# Altium schematic sheet CW342_Edge.SchDoc: <Enter Sheet Title>
size Letter; Organization: NewAE Technology Inc.; Address1: 1083 Queen St., Suite 196; Address2: Halifax; Address3: NS; Address4: Canada B3H 0B2; SheetNumber: 1; SheetTotal: 9; SheetApproved: NO
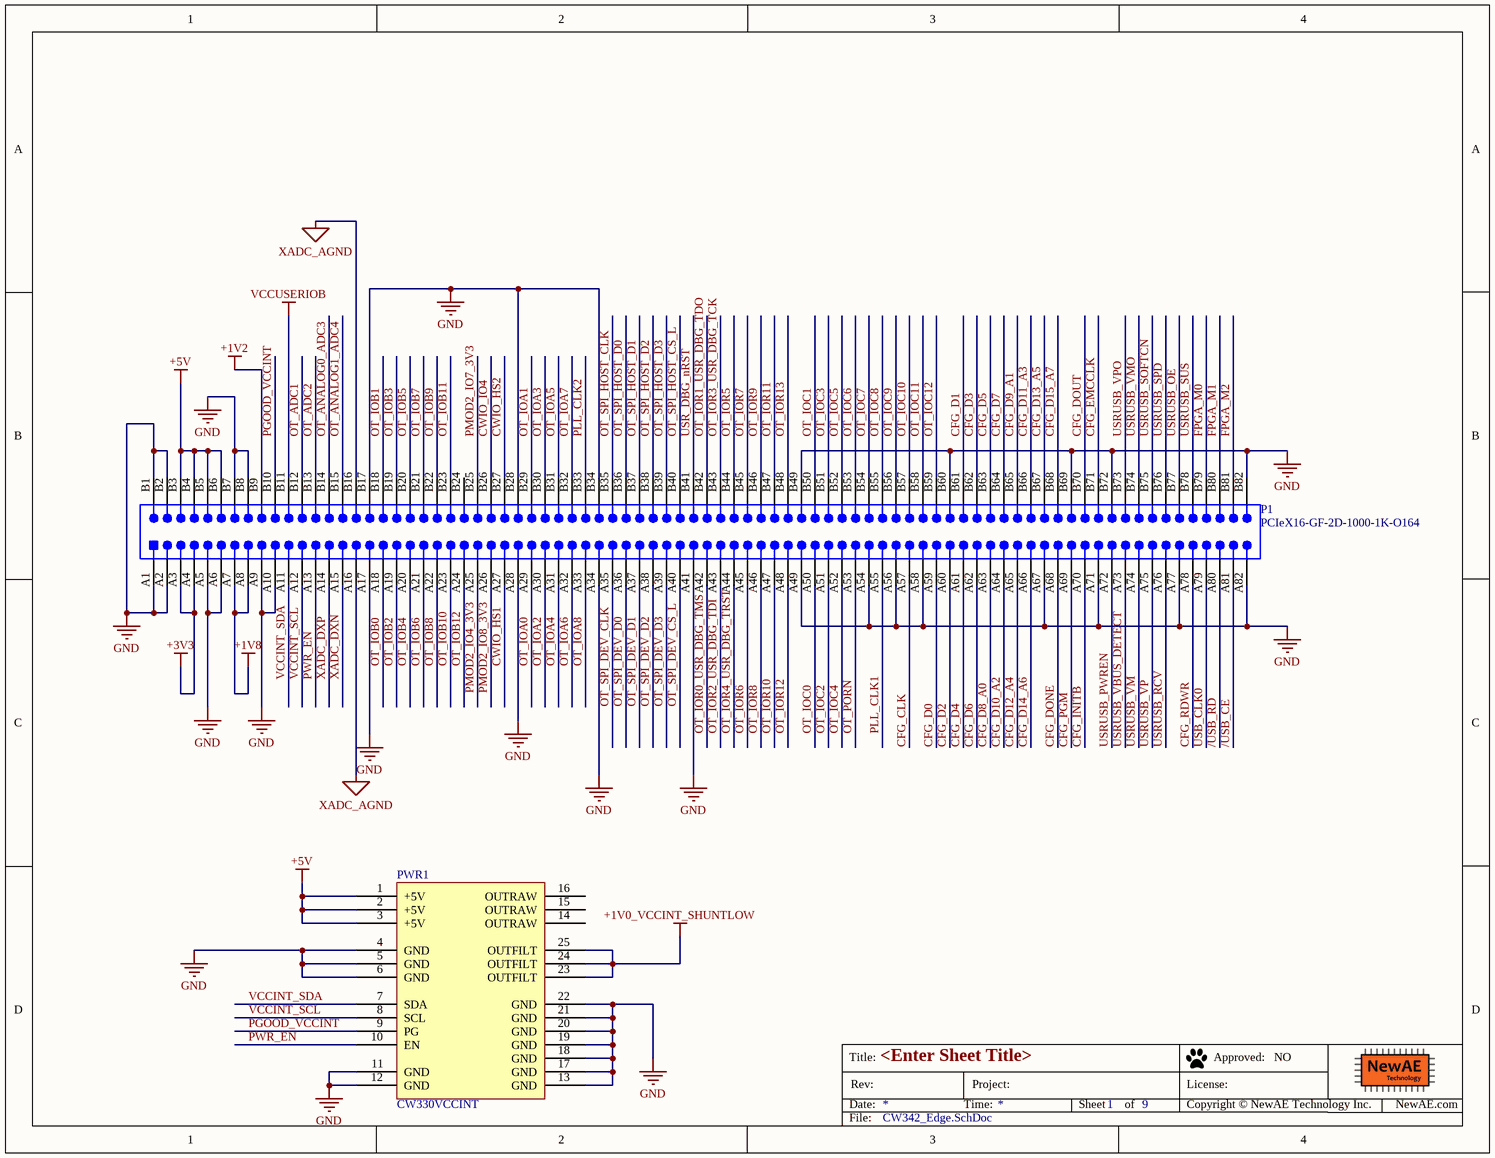
[diagram p0: CW342_Edge.SchDoc]

## Parts
P1  PCIeX16-GF-2D-1000-1K-O164  [PCIeX16-GF-2D-1000-1K-O164]
PWR1  CW330VCCINT  [CW335_VCCINT_POWERSUPPLY]

## Nets
+1V0_VCCINT_SHUNTLOW: PWR1.23(OUTFILT) PWR1.24(OUTFILT) PWR1.25(OUTFILT)
+1V2: P1.B9
+1V8: P1.A7 P1.A8
+3V3: P1.A3 P1.A4
+5V: P1.B3 P1.B4 P1.B5 P1.B6 PWR1.1(+5V) PWR1.2(+5V) PWR1.3(+5V)
GND: P1.A1 P1.A2 P1.A5 P1.A6 P1.A9 P1.A10 P1.A17 P1.A28 P1.A34 P1.A41 P1.A49 P1.A54 P1.A56 P1.A58 P1.A67 P1.A71 P1.A77 P1.A82 P1.B1 P1.B2 P1.B7 P1.B8 P1.B17 P1.B28 P1.B34 P1.B49 P1.B60 P1.B69 P1.B72 P1.B82 PWR1.4(GND) PWR1.5(GND) PWR1.6(GND) PWR1.11(GND) PWR1.12(GND) PWR1.13(GND) PWR1.17(GND) PWR1.18(GND) PWR1.19(GND) PWR1.20(GND) PWR1.21(GND) PWR1.22(GND)
VCCUSERIOB: P1.B11
XADC_AGND: P1.A16 P1.B16
/USB_CE: P1.A81
/USB_RD: P1.A80
CFG_CLK: P1.A57
CFG_D0: P1.A59
CFG_D1: P1.B61
CFG_D2: P1.A60
CFG_D3: P1.B62
CFG_D4: P1.A61
CFG_D5: P1.B63
CFG_D6: P1.A62
CFG_D7: P1.B64
CFG_D8_A0: P1.A63
CFG_D9_A1: P1.B65
CFG_D10_A2: P1.A64
CFG_D11_A3: P1.B66
CFG_D12_A4: P1.A65
CFG_D13_A5: P1.B67
CFG_D14_A6: P1.A66
CFG_D15_A7: P1.B68
CFG_DONE: P1.A68
CFG_DOUT: P1.B70
CFG_EMCCLK: P1.B71
CFG_INITB: P1.A70
CFG_PGM: P1.A69
CFG_RDWR: P1.A78
CWIO_HS1: P1.A27
CWIO_HS2: P1.B27
CWIO_IO4: P1.B26
FPGA_M0: P1.B79
FPGA_M1: P1.B80
FPGA_M2: P1.B81
OT_ADC1: P1.B12
OT_ADC2: P1.B13
OT_ANALOG0_ADC3: P1.B14
OT_ANALOG1_ADC4: P1.B15
OT_IOA0: P1.A29
OT_IOA1: P1.B29
OT_IOA2: P1.A30
OT_IOA3: P1.B30
OT_IOA4: P1.A31
OT_IOA5: P1.B31
OT_IOA6: P1.A32
OT_IOA7: P1.B32
OT_IOA8: P1.A33
OT_IOB0: P1.A18
OT_IOB1: P1.B18
OT_IOB2: P1.A19
OT_IOB3: P1.B19
OT_IOB4: P1.A20
OT_IOB5: P1.B20
OT_IOB6: P1.A21
OT_IOB7: P1.B21
OT_IOB8: P1.A22
OT_IOB9: P1.B22
OT_IOB10: P1.A23
OT_IOB11: P1.B23
OT_IOB12: P1.A24
OT_IOC0: P1.A50
OT_IOC1: P1.B50
OT_IOC2: P1.A51
OT_IOC3: P1.B51
OT_IOC4: P1.A52
OT_IOC5: P1.B52
OT_IOC6: P1.B53
OT_IOC7: P1.B54
OT_IOC8: P1.B55
OT_IOC9: P1.B56
OT_IOC10: P1.B57
OT_IOC11: P1.B58
OT_IOC12: P1.B59
OT_IOR0_USR_DBG_TMS: P1.A42
OT_IOR1_USR_DBG_TDO: P1.B42
OT_IOR2_USR_DBG_TDI: P1.A43
OT_IOR3_USR_DBG_TCK: P1.B43
OT_IOR4_USR_DBG_TRST: P1.A44
OT_IOR5: P1.B44
OT_IOR6: P1.A45
OT_IOR7: P1.B45
OT_IOR8: P1.A46
OT_IOR9: P1.B46
OT_IOR10: P1.A47
OT_IOR11: P1.B47
OT_IOR12: P1.A48
OT_IOR13: P1.B48
OT_PORN: P1.A53
OT_SPI_DEV_CLK: P1.A35
OT_SPI_DEV_CS_L: P1.A40
OT_SPI_DEV_D0: P1.A36
OT_SPI_DEV_D1: P1.A37
OT_SPI_DEV_D2: P1.A38
OT_SPI_DEV_D3: P1.A39
OT_SPI_HOST_CLK: P1.B35
OT_SPI_HOST_CS_L: P1.B40
OT_SPI_HOST_D0: P1.B36
OT_SPI_HOST_D1: P1.B37
OT_SPI_HOST_D2: P1.B38
OT_SPI_HOST_D3: P1.B39
PGOOD_VCCINT: P1.B10 PWR1.9(PG)
PLL_CLK1: P1.A55
PLL_CLK2: P1.B33
PMOD2_IO4_3V3: P1.A25
PMOD2_IO7_3V3: P1.B25
PMOD2_IO8_3V3: P1.A26
PWR_EN: P1.A13 PWR1.10(EN)
USB_CLK0: P1.A79
USR_DBG_nRST: P1.B41
USRUSB_OE: P1.B77
USRUSB_PWREN: P1.A72
USRUSB_RCV: P1.A76
USRUSB_SOFTCN: P1.B75
USRUSB_SPD: P1.B76
USRUSB_SUS: P1.B78
USRUSB_VBUS_DETECT: P1.A73
USRUSB_VM: P1.A74
USRUSB_VMO: P1.B74
USRUSB_VP: P1.A75
USRUSB_VPO: P1.B73
VCCINT_SCL: P1.A12 PWR1.8(SCL)
VCCINT_SDA: P1.A11 PWR1.7(SDA)
XADC_DXN: P1.A15
XADC_DXP: P1.A14

Not connected (* = marked no-connect by the designer): P1 B24; PWR1 14(OUTRAW) 15(OUTRAW) 16(OUTRAW)

## Notes on the sheet
- Title:
- Date:
- Rev:
- Time:
- Project:
- Sheet
- of
- License:
- Copyright © NewAE Technology Inc.
- Approved:
- NewAE.com
- File:

## Library data of the parts
P1 = CMP-002-00047-1: Golden Finger, PCIeX16, Dual, Opposite, Pitch 1mm, 164-Position; Connector Type: EdgeConnector; Gender: Male; Mounting Technology: SM; Pins: 164; Case/Package: PCIeX16-GF-2D-1000-1K-O164; Package Description: Edge Connector, Golden Finger, Pitch 1 mm, 2 x 82 Position; Package Reference: PCIeX16-GF-2D-1000-1K-O164